# Altium schematic sheet connect.SchDoc
size A4
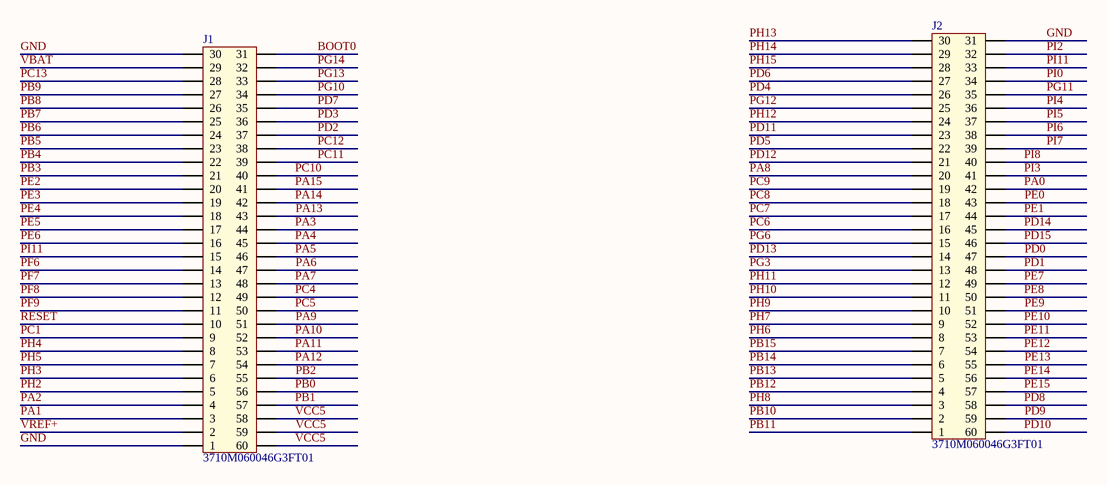
[diagram p0: connect.SchDoc]

## Parts
J1  3710M060046G3FT01  [3710F060046G3FT01]
J2  3710M060046G3FT01  [3710F060046G3FT01]

## Nets
BOOT0: J1.31
GND: J1.1 J1.30 J2.31
PA0: J2.42
PA1: J1.3
PA2: J1.4
PA3: J1.44
PA4: J1.45
PA5: J1.46
PA6: J1.47
PA7: J1.48
PA8: J2.20
PA9: J1.51
PA10: J1.52
PA11: J1.53
PA12: J1.54
PA13: J1.43
PA14: J1.42
PA15: J1.41
PB0: J1.56
PB1: J1.57
PB2: J1.55
PB3: J1.21
PB4: J1.22
PB5: J1.23
PB6: J1.24
PB7: J1.25
PB8: J1.26
PB9: J1.27
PB10: J2.2
PB11: J2.1
PB12: J2.4
PB13: J2.5
PB14: J2.6
PB15: J2.7
PC1: J1.9
PC4: J1.49
PC5: J1.50
PC6: J2.16
PC7: J2.17
PC8: J2.18
PC9: J2.19
PC10: J1.40
PC11: J1.39
PC12: J1.38
PC13: J1.28
PD0: J2.47
PD1: J2.48
PD2: J1.37
PD3: J1.36
PD4: J2.26
PD5: J2.22
PD6: J2.27
PD7: J1.35
PD8: J2.58
PD9: J2.59
PD10: J2.60
PD11: J2.23
PD12: J2.21
PD13: J2.14
PD14: J2.45
PD15: J2.46
PE0: J2.43
PE1: J2.44
PE2: J1.20
PE3: J1.19
PE4: J1.18
PE5: J1.17
PE6: J1.16
PE7: J2.49
PE8: J2.50
PE9: J2.51
PE10: J2.52
PE11: J2.53
PE12: J2.54
PE13: J2.55
PE14: J2.56
PE15: J2.57
PF6: J1.14
PF7: J1.13
PF8: J1.12
PF9: J1.11
PG3: J2.13
PG6: J2.15
PG10: J1.34
PG11: J2.35
PG12: J2.25
PG13: J1.33
PG14: J1.32
PH2: J1.5
PH3: J1.6
PH4: J1.8
PH5: J1.7
PH6: J2.8
PH7: J2.9
PH8: J2.3
PH9: J2.10
PH10: J2.11
PH11: J2.12
PH12: J2.24
PH13: J2.30
PH14: J2.29
PH15: J2.28
PI0: J2.34
PI2: J2.32
PI3: J2.41
PI4: J2.36
PI5: J2.37
PI6: J2.38
PI7: J2.39
PI8: J2.40
PI11: J1.15 J2.33
RESET: J1.10
VBAT: J1.29
VCC5: J1.58 J1.59 J1.60
VREF+: J1.2

## Library data of the parts
J1 J2 = 3710F: 3710F060046G3FT01